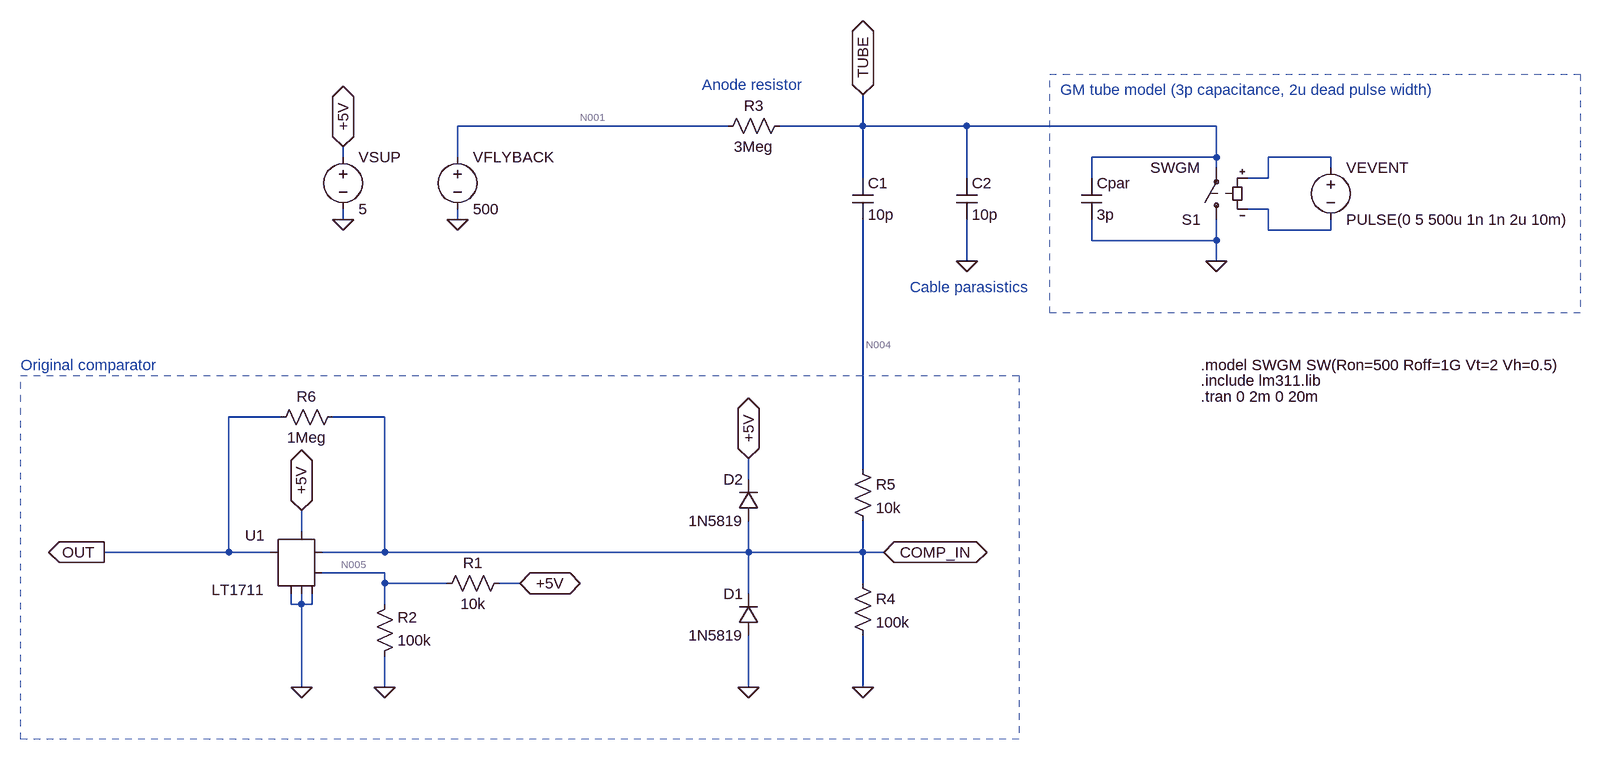
[diagram p0: schematic LM311_Comp.asc]
LM311_Comp.asc, the LTspice schematic file:
Version 4.1
SHEET 1 1448 1080
WIRE 32 16 -384 16
WIRE 240 16 240 -32
WIRE 240 16 112 16
WIRE 400 16 240 16
WIRE 784 16 400 16
WIRE -560 64 -560 48
WIRE -384 64 -384 16
WIRE 784 64 784 16
WIRE 784 64 592 64
WIRE 960 64 864 64
WIRE 784 80 784 64
WIRE 960 80 960 64
WIRE 240 96 240 16
WIRE 400 96 400 16
WIRE 592 96 592 64
WIRE 864 96 864 64
WIRE 864 96 832 96
WIRE 864 144 832 144
WIRE -560 160 -560 144
WIRE -384 160 -384 144
WIRE 864 176 864 144
WIRE 960 176 960 160
WIRE 960 176 864 176
WIRE 592 192 592 160
WIRE 784 192 784 160
WIRE 784 192 592 192
WIRE 400 224 400 160
WIRE 784 224 784 192
WIRE -656 464 -736 464
WIRE -496 464 -576 464
WIRE 240 544 240 160
WIRE 64 560 64 528
WIRE -624 640 -624 608
WIRE -736 672 -736 464
WIRE -736 672 -928 672
WIRE -672 672 -736 672
WIRE -496 672 -496 464
WIRE -496 672 -592 672
WIRE 64 672 64 624
WIRE 64 672 -496 672
WIRE 240 672 240 624
WIRE 240 672 64 672
WIRE 272 672 240 672
WIRE -496 704 -592 704
WIRE -496 720 -496 704
WIRE -400 720 -496 720
WIRE -288 720 -320 720
WIRE 240 720 240 672
WIRE 64 736 64 672
WIRE -640 752 -640 736
WIRE -624 752 -624 736
WIRE -624 752 -640 752
WIRE -608 752 -608 736
WIRE -608 752 -624 752
WIRE -496 752 -496 720
WIRE -624 880 -624 752
WIRE -496 880 -496 832
WIRE 64 880 64 800
WIRE 240 880 240 800
FLAG -288 720 +5V
IOPIN -288 720 BiDir
FLAG 784 224 0
FLAG -560 160 0
FLAG -560 48 +5V
IOPIN -560 48 BiDir
FLAG -384 160 0
FLAG -624 880 0
FLAG -928 672 OUT
IOPIN -928 672 Out
FLAG 240 -32 TUBE
IOPIN 240 -32 BiDir
FLAG 272 672 COMP_IN
IOPIN 272 672 BiDir
FLAG 400 224 0
FLAG -496 880 0
FLAG -624 608 +5V
IOPIN -624 608 BiDir
FLAG 240 880 0
FLAG 64 880 0
FLAG 64 528 +5V
IOPIN 64 528 BiDir
SYMBOL cap 224 96 R0
SYMATTR InstName C1
SYMATTR Value 10p
SYMBOL sw 784 176 R180
SYMATTR InstName S1
SYMATTR Value SWGM
SYMBOL cap 576 96 R0
SYMATTR InstName Cpar
SYMATTR Value 3p
SYMBOL res 128 0 R90
WINDOW 0 0 56 VBottom 2
WINDOW 3 32 56 VTop 2
SYMATTR InstName R3
SYMATTR Value 3Meg
SYMBOL voltage 960 64 R0
WINDOW 123 0 0 Left 0
WINDOW 39 0 0 Left 0
SYMATTR InstName VEVENT
SYMATTR Value PULSE(0 5 500u 1n 1n 2u 10m)
SYMBOL voltage -384 48 R0
WINDOW 123 0 0 Left 0
WINDOW 39 0 0 Left 0
SYMATTR InstName VFLYBACK
SYMATTR Value 500
SYMBOL voltage -560 48 R0
WINDOW 123 0 0 Left 0
WINDOW 39 0 0 Left 0
SYMATTR InstName VSUP
SYMATTR Value 5
SYMBOL cap 384 96 R0
SYMATTR InstName C2
SYMATTR Value 10p
SYMBOL Comparators\\LT1711 -624 688 M0
SYMATTR InstName U1
SYMBOL res -304 704 R90
WINDOW 0 0 56 VBottom 2
WINDOW 3 32 56 VTop 2
SYMATTR InstName R1
SYMATTR Value 10k
SYMBOL res -512 848 M180
WINDOW 0 36 76 Left 2
WINDOW 3 36 40 Left 2
SYMATTR InstName R2
SYMATTR Value 100k
SYMBOL res 224 704 R0
SYMATTR InstName R4
SYMATTR Value 100k
SYMBOL res 224 528 R0
SYMATTR InstName R5
SYMATTR Value 10k
SYMBOL diode 80 800 R180
WINDOW 0 24 64 Left 2
WINDOW 3 24 0 Left 2
SYMATTR InstName D1
SYMATTR Value 1N5819
SYMATTR Description Diode
SYMATTR Type diode
SYMBOL diode 80 624 R180
WINDOW 0 24 64 Left 2
WINDOW 3 24 0 Left 2
SYMATTR InstName D2
SYMATTR Value 1N5819
SYMATTR Description Diode
SYMATTR Type diode
SYMBOL res -560 448 R90
WINDOW 0 0 56 VBottom 2
WINDOW 3 32 56 VTop 2
SYMATTR InstName R6
SYMATTR Value 1Meg
TEXT 760 408 Left 2 !.include lm311.lib
TEXT 760 384 Left 2 !.model SWGM SW(Ron=500 Roff=1G Vt=2 Vh=0.5)
TEXT 760 432 Left 2 !.tran 0 2m 0 20m
TEXT 544 -40 Left 2 ;GM tube model (3p capacitance, 2u dead pulse width)
TEXT -1056 384 Left 2 ;Original comparator
TEXT -8 -48 Left 2 ;Anode resistor
TEXT 312 264 Left 2 ;Cable parasistics
RECTANGLE Normal 1344 304 528 -64 2
RECTANGLE Normal 480 960 -1056 400 2

The netlist it stands for:
* LM311_Comp.asc
C1 TUBE N004 10p
S1 0 TUBE N002 N003 SWGM
Cpar TUBE 0 3p
R3 TUBE N001 3Meg
VEVENT N002 N003 PULSE(0 5 500u 1n 1n 2u 10m)
VFLYBACK N001 0 500
VSUP +5V 0 5
C2 TUBE 0 10p
X§U1 N005 COMP_IN +5V 0 0 OUT NC_01 0 LT1711
R1 +5V N005 10k
R2 0 N005 100k
R4 COMP_IN 0 100k
R5 N004 COMP_IN 10k
D1 0 COMP_IN 1N5819
D2 COMP_IN +5V 1N5819
R6 COMP_IN OUT 1Meg
.model D D
.lib standard.dio
.include lm311.lib
.model SWGM SW(Ron=500 Roff=1G Vt=2 Vh=0.5)
.tran 0 2m 0 20m
* GM tube model (3p capacitance, 2u dead pulse width)
* Original comparator
* Anode resistor
* Cable parasistics
.backanno
.end

* Results of the author's LTspice run, read from the files saved beside the schematic
* Operating Point, zero values left out:
*   V(+5v) = 5 V
*   V(comp_in) = 1.019 V
*   V(n001) = 500 V
*   V(n004) = 1.019 V
*   V(n005) = 4.528 V
*   V(out) = 5 V
*   V(tube) = 498.5 V
*   I(D1) = -31.7 µA
*   I(D2) = -31.7 µA
*   I(R1) = 47.18 µA
*   I(R2) = -45.28 µA
*   I(R3) = -499 nA
*   I(R4) = 10.19 µA
*   I(R6) = -3.981 µA
*   I(S1) = 499 nA
*   I(VFLYBACK) = -499 nA
*   I(VSUP) = -15.1 mA
*   Ix(u1:1) = 1.901 µA
*   Ix(u1:2) = -6.213 µA
*   Ix(u1:3) = 15.02 mA
*   Ix(u1:4) = -8 mA
*   Ix(u1:5) = -7.011 mA
*   Ix(u1:6) = -3.981 µA
*   Ix(u1:7) = 5 pA
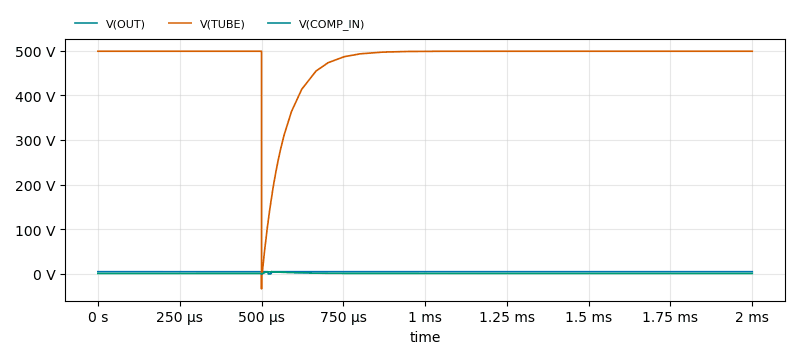
[diagram p1: Transient Analysis of LM311_Comp.asc, plotted from the saved traces]
* Transient Analysis, 1 run:
*   V(OUT): min -3.624 mV, max 5 V, average 4.977 V, rms 4.988 V, last 5 V
*   V(TUBE): min -33.4 V, max 498.5 V, average 480.9 V, rms 485.2 V, last 498.5 V
*   V(COMP_IN): min -262.8 mV, max 4.569 V, average 1.203 V, rms 1.355 V, last 1.019 V